# Altium schematic sheet 12_CONSOLE.SchDoc
size 420 x 297 mm; SheetNumber: 21; SheetTotal: 33
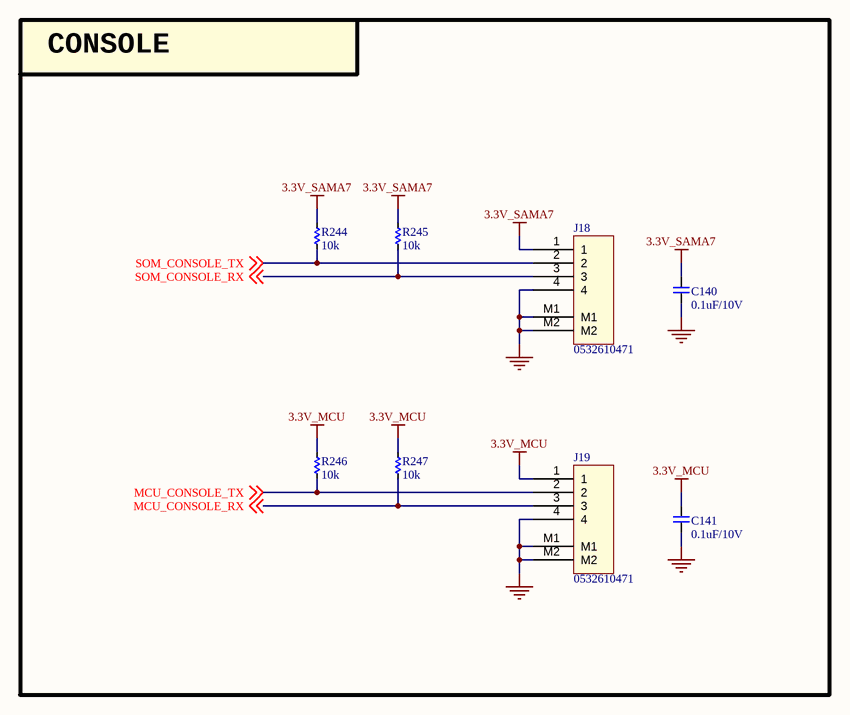
[diagram p0: 12_CONSOLE.SchDoc]

## Parts
C140  0.1uF/10V  [CAP_C_1005X50_L]
C141  0.1uF/10V  [CAP_C_1005X50_L]
J18  0532610471  [MOLEX_0532610471]
J19  0532610471  [MOLEX_0532610471]
R244  10k  [RES_C_1005x30_L]
R245  10k  [RES_C_1005x30_L]
R246  10k  [RES_C_1005x30_L]
R247  10k  [RES_C_1005x30_L]

## Blocks framed on the sheet
CONSOLE: C140 C141 J18 J19 R244-R247

## Nets
3.3V_MCU: C141.2 J19.1 R246.2 R247.2
3.3V_SAMA7: C140.2 J18.1 R244.2 R245.2
GND: C140.1 C141.1 J18.4 J18.M1 J18.M2 J19.4 J19.M1 J19.M2
MCU_CONSOLE_RX: J19.3 R247.1 ; off-sheet MCU_CONSOLE_RX
MCU_CONSOLE_TX: J19.2 R246.1 ; off-sheet MCU_CONSOLE_TX
SOM_CONSOLE_RX: J18.3 R245.1 ; off-sheet SOM_CONSOLE_RX
SOM_CONSOLE_TX: J18.2 R244.1 ; off-sheet SOM_CONSOLE_TX

## Notes on the sheet
- Project:
- BEE-1012
- Sub-system:
- SATELLITE_EXP_CONTROLLER
- Design by:
- SANG HUYNH
- BAO BUI
- Sheet title:
- Sheet
- A3
- of
- Checked by:
- Approved by:
- VU PHAM
- Revision:
- Document No:
- Size:
- Date:

## Library data of the parts
C140 C141 = _CAP_C_2: CAP
J18 J19 = Header 4x1_2M
R244-R247 = _RES_B_2: RES